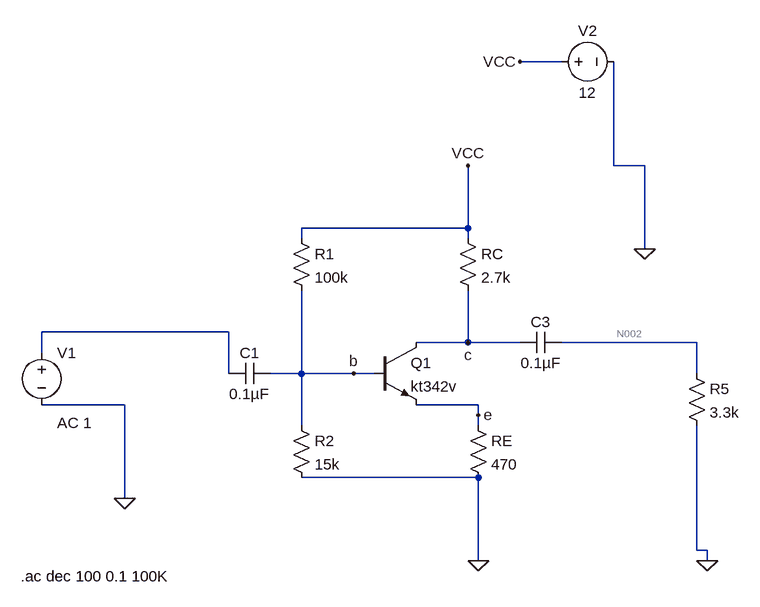
[diagram p0: schematic Draft6.asc]
Draft6.asc, the LTspice schematic file:
Version 4
SHEET 1 3952 680
WIRE 896 -304 832 -304
WIRE 976 -144 976 -304
WIRE 1024 -144 976 -144
WIRE 752 -48 752 -144
WIRE 752 -48 496 -48
WIRE 496 -32 496 -48
WIRE 752 -32 752 -48
WIRE 1024 -16 1024 -144
WIRE 384 112 96 112
WIRE 752 128 752 48
WIRE 752 128 672 128
WIRE 832 128 752 128
WIRE 1104 128 896 128
WIRE 96 144 96 112
WIRE 384 176 384 112
WIRE 496 176 496 48
WIRE 496 176 448 176
WIRE 576 176 496 176
WIRE 608 176 576 176
WIRE 1104 176 1104 128
WIRE 224 224 96 224
WIRE 768 224 672 224
WIRE 768 240 768 224
WIRE 496 256 496 176
WIRE 768 256 768 240
WIRE 768 336 496 336
WIRE 224 368 224 224
WIRE 1104 448 1104 256
WIRE 1120 448 1104 448
WIRE 768 464 768 336
WIRE 1120 464 1120 448
FLAG 224 368 0
FLAG 768 464 0
FLAG 1120 464 0
FLAG 1024 -16 0
FLAG 576 176 b
FLAG 752 128 c
FLAG 768 240 e
FLAG 832 -304 VCC
FLAG 752 -144 VCC
SYMBOL voltage 96 128 R0
WINDOW 123 24 124 Left 2
WINDOW 39 0 0 Left 0
SYMATTR Value2 AC 1
SYMATTR InstName V1
SYMATTR Value ""
SYMBOL cap 448 160 R90
WINDOW 0 0 32 VBottom 2
WINDOW 3 32 32 VTop 2
SYMATTR InstName C1
SYMATTR Value 0.1µF
SYMBOL res 480 -48 R0
SYMATTR InstName R1
SYMATTR Value 100k
SYMBOL res 480 240 R0
SYMATTR InstName R2
SYMATTR Value 15k
SYMBOL res 736 -48 R0
SYMATTR InstName RC
SYMATTR Value 2.7k
SYMBOL res 752 240 R0
SYMATTR InstName RE
SYMATTR Value 470
SYMBOL cap 832 112 M90
WINDOW 0 0 32 VBottom 2
WINDOW 3 32 32 VTop 2
SYMATTR InstName C3
SYMATTR Value 0.1µF
SYMBOL res 1088 160 R0
SYMATTR InstName R5
SYMATTR Value 3.3k
SYMBOL npn 608 128 R0
SYMATTR InstName Q1
SYMATTR Value kt342v
SYMBOL voltage 880 -304 R270
WINDOW 0 32 56 VTop 2
WINDOW 3 -32 56 VBottom 2
WINDOW 123 0 0 Left 0
WINDOW 39 0 0 Left 0
SYMATTR InstName V2
SYMATTR Value 12
TEXT 64 488 Left 2 !.ac dec 100 0.1 100K

The netlist it stands for:
* Draft6.asc
V1 N001 0 AC 1
C1 b N001 0.1µF
R1 VCC b 100k
R2 b 0 15k
RC VCC c 2.7k
RE e 0 470
C3 c N002 0.1µF
R5 N002 0 3.3k
Q1 c b e 0 kt342v
V2 VCC 0 12
.model NPN NPN
.model PNP PNP
.lib standard.bjt
.ac dec 100 0.1 100K
.backanno
.end

* Results of the author's LTspice run, read from the files saved beside the schematic
* Operating Point, zero values left out:
*   V(b) = 1.527 V
*   V(vcc) = 12 V
*   V(c) = 7.002 V
*   V(e) = 871.5 mV
*   Ic(Q1) = 1.851 mA
*   Ib(Q1) = 2.93 µA
*   Ie(Q1) = -1.854 mA
*   I(Re) = 1.854 mA
*   I(Rc) = 1.851 mA
*   I(R2) = 101.8 µA
*   I(R1) = 104.7 µA
*   I(V2) = -1.956 mA
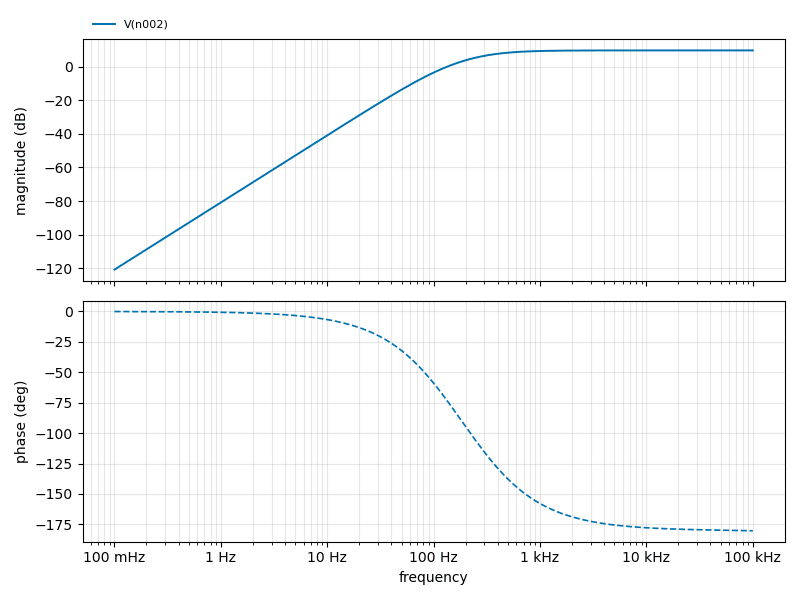
[diagram p1: AC Analysis of Draft6.asc, plotted from the saved traces]
* AC Analysis, 1 run:
*   V(n002): -120.85 dB at 100 mHz, 9.68 dB at 100 kHz, peak 9.68 dB at 74.13 kHz, 3 dB below the peak at 313.1 Hz